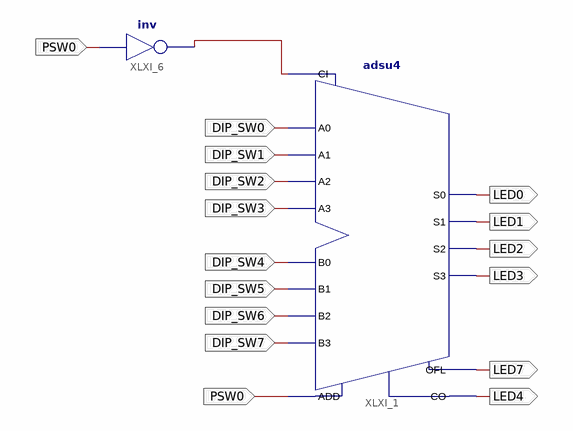
[diagram p0: schematic sheet 1]
// Xilinx ISE schematic lab5_7_adsu4.sch (spartan3) as structural Verilog: 2 symbols, 15 ports
module lab5_7_adsu4 (
  input  DIP_SW0,
  input  DIP_SW1,
  input  DIP_SW2,
  input  DIP_SW3,
  input  DIP_SW4,
  input  DIP_SW5,
  input  DIP_SW6,
  input  DIP_SW7,
  input  PSW0,
  output LED0,
  output LED1,
  output LED2,
  output LED3,
  output LED7,
  output LED4
);

  wire XLXN_9;

  adsu4 XLXI_1 (
    .A0(DIP_SW0), .A1(DIP_SW1), .A2(DIP_SW2), .A3(DIP_SW3), .ADD(PSW0), .B0(DIP_SW4), .B1(DIP_SW5),
    .B2(DIP_SW6), .B3(DIP_SW7), .CI(XLXN_9), .CO(LED4), .OFL(LED7), .S0(LED0), .S1(LED1), .S2(LED2), .S3(LED3));
  not XLXI_6 (XLXN_9, PSW0);
endmodule
